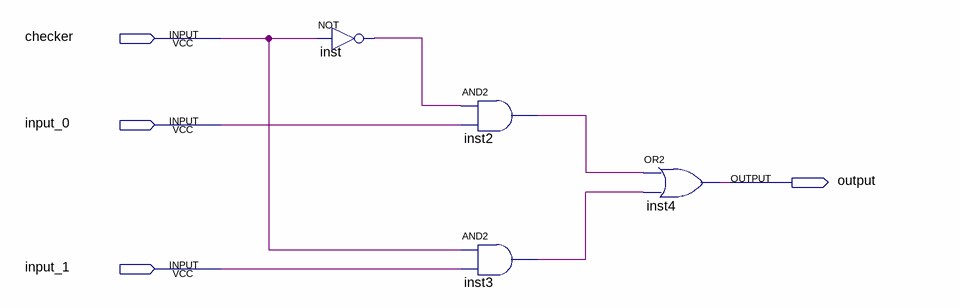
[diagram p0: schematic sheet]
// Quartus schematic mux.bdf as structural Verilog: 4 symbols, 4 pins
module mux (
  input  \checker ,
  input  input_0,
  input  input_1,
  output \output 
);

  wire inst2_out, inst3_out, inst_out;

  not inst (inst_out, \checker );
  and inst2 (inst2_out, inst_out, input_0);
  and inst3 (inst3_out, \checker , input_1);
  or inst4 (\output , inst2_out, inst3_out);
endmodule
